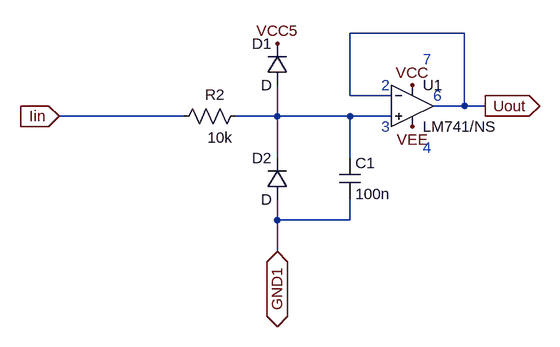
[diagram p0: schematic 2Viestinvalitys_vastaanotin.asc]
2Viestinvalitys_vastaanotin.asc, the LTspice schematic file:
Version 4.1
SHEET 1 900 680
WIRE 752 0 576 0
WIRE 576 96 576 0
WIRE 640 96 576 96
WIRE 752 112 752 0
WIRE 752 112 704 112
WIRE 784 112 752 112
WIRE 320 128 128 128
WIRE 464 128 464 80
WIRE 464 128 400 128
WIRE 576 128 464 128
WIRE 640 128 576 128
WIRE 464 192 464 128
WIRE 576 192 576 128
WIRE 464 288 464 256
WIRE 576 288 576 256
WIRE 576 288 464 288
WIRE 464 336 464 288
FLAG 128 128 Iin
IOPIN 128 128 In
FLAG 672 80 VCC
FLAG 672 144 VEE
FLAG 464 16 VCC5
FLAG 784 112 Uout
IOPIN 784 112 Out
FLAG 464 336 GND1
IOPIN 464 336 BiDir
SYMBOL res 416 112 R90
WINDOW 0 -2 48 VBottom 2
WINDOW 3 33 40 VTop 2
SYMATTR InstName R2
SYMATTR Value 10k
SYMBOL diode 480 80 R180
WINDOW 0 24 64 Left 2
WINDOW 3 24 0 Left 2
SYMATTR InstName D1
SYMBOL diode 480 256 R180
WINDOW 0 24 64 Left 2
WINDOW 3 24 0 Left 2
SYMATTR InstName D2
SYMBOL cap 560 192 R0
SYMATTR InstName C1
SYMATTR Value 100n
SYMBOL OpAmps\\opamp2 672 48 R0
SYMATTR InstName U1
SYMATTR Value LM741/NS
TEXT 624 80 Left 2 ;2
TEXT 624 144 Left 2 ;3
TEXT 688 40 Left 2 ;7
TEXT 704 96 Left 2 ;6
TEXT 688 176 Left 2 ;4

The netlist it stands for:
* 2Viestinvalitys_vastaanotin.asc
R2 N001 Iin 10k
D1 N001 VCC5 D
D2 GND1 N001 D
C1 N001 GND1 100n
X§U1 N001 Uout VCC VEE Uout LM741/NS  ; pins In+ In- V+ V- OUT
.model D D
.lib standard.dio
* 2
* 3
* 7
* 6
* 4
.backanno
.end